# EAGLE schematic TestNode V1 (EAGLE 6.4)
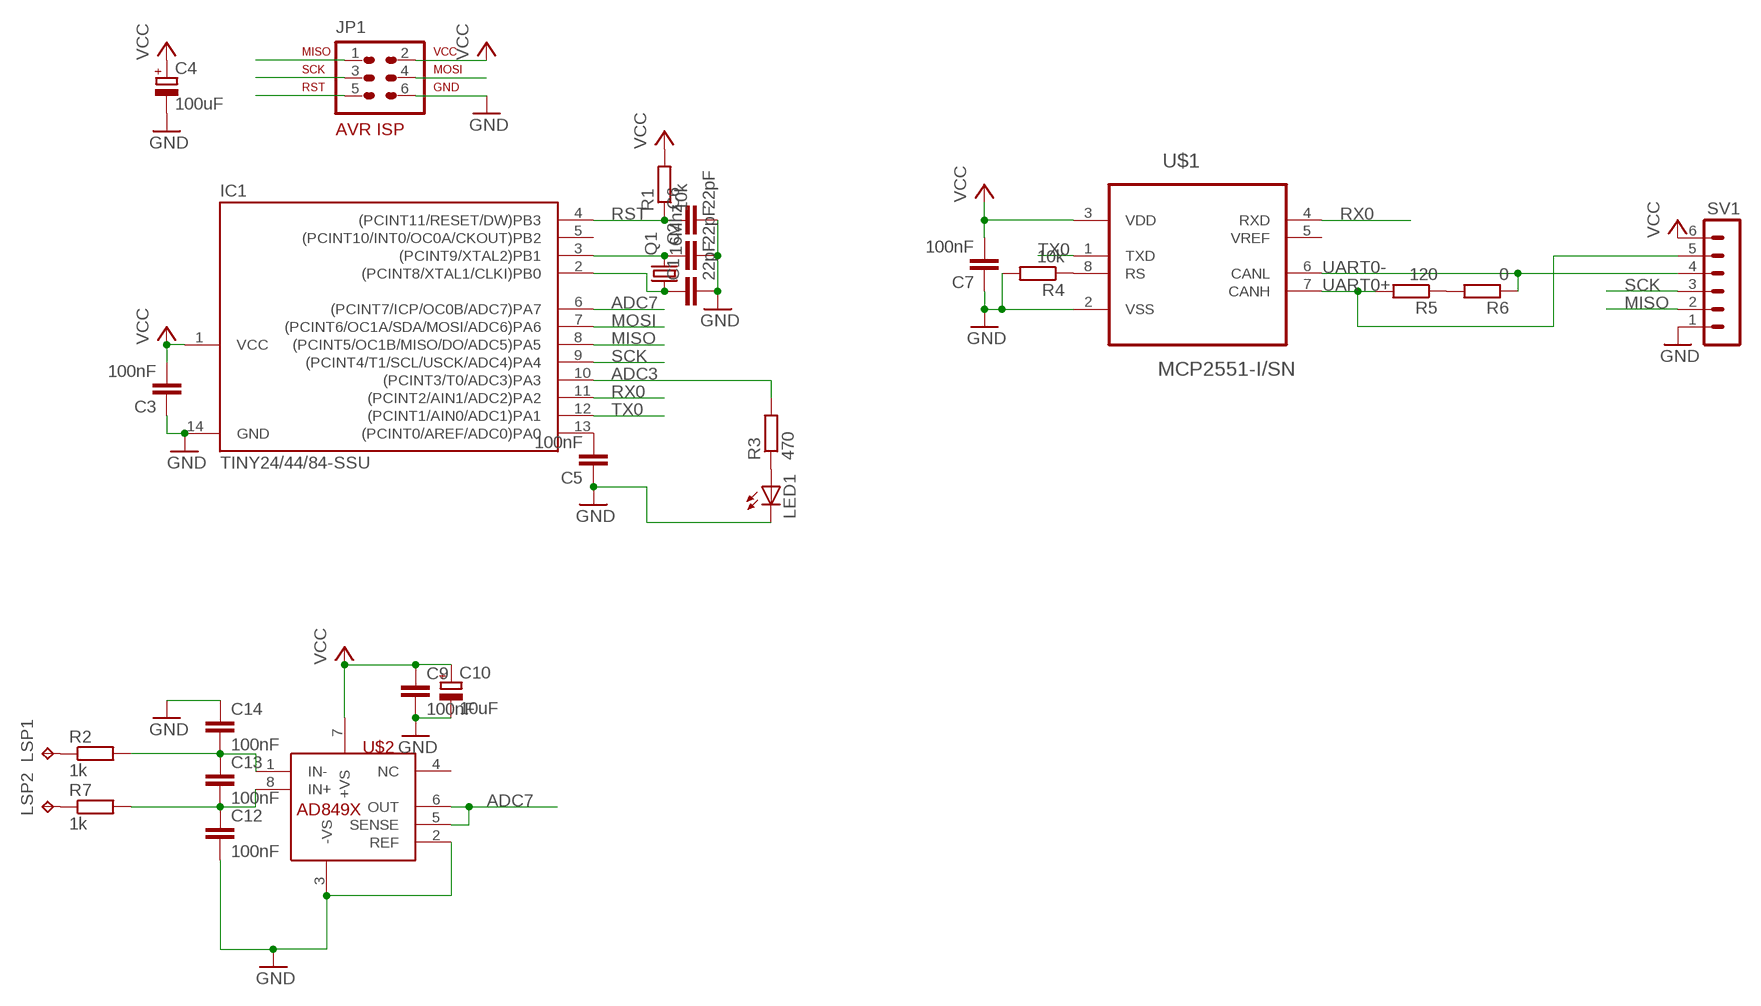
[diagram p0: schematic, sheet 1]

## Parts
C1  22pF  C-EUC1206  [C1206]
C2  22pF  C-EUC1206  [C1206]
C3  100nF  C-EUC1206  [C1206]
C4  100uF  CPOL-EUD  [PANASONIC_D]
C5  100nF  C-EUC1206  [C1206]
C6  22pF  C-EUC1206  [C1206]
C7  100nF  C-EUC1206  [C1206]
C9  100nF  C-EUC1206  [C1206]
C10  10uF  CPOL-EUUD-4X5,8  [UD-4X5,8_NICHICON]
C12  100nF  C-EUC0805  [C0805]
C13  100nF  C-EUC0805  [C0805]
C14  100nF  C-EUC0805  [C0805]
IC1  TINY24/44/84-SSU  [SOIC14]
JP1  AVR-ISP-6VERT  [AVR-ISP-6]
LED1  LED5MM  [LED5MM]
LSP1  TPTP15R  [TP15R]
LSP2  TPTP15R  [TP15R]
Q1  16Mhz  CRYSTALSM49  [SM49]
R1  10k  R-EU_R1206  [R1206]
R2  1k  R-EU_R0805  [R0805]
R3  470  R-EU_R1206  [R1206]
R4  10k  R-EU_R1206  [R1206]
R5  120  R-EU_R1206  [R1206]
R6  0  R-EU_R1206  [R1206]
R7  1k  R-EU_R0805  [R0805]
SV1  MA06-1  [MA06-1]
U$1  MCP2551-I/SN  [SOIC127P600X175-8N]
U$2  AD849X  [MSOP8]

## Nets
ADC3: IC1.10((PCINT3/T0/ADC3)PA3) R3.2
ADC7: IC1.6((PCINT7/ICP/OC0B/ADC7)PA7) U$2.5(SENSE) U$2.6(OUT)
GND: C1.2 C2.2 C3.1 C4.- C5.1 C6.2 C7.1 C9.2 C10.- C12.2 C14.1 IC1.14(GND) JP1.6 LED1.K(C) R4.2 SV1.1 U$1.2(VSS) U$2.2(REF) U$2.3(-VS)
MISO: IC1.8((PCINT5/OC1B/MISO/DO/ADC5)PA5) JP1.1 SV1.2
MOSI: IC1.7((PCINT6/OC1A/SDA/MOSI/ADC6)PA6) JP1.4
N$1: C1.1 IC1.2((PCINT8/XTAL1/CLKI)PB0) Q1.1
N$2: C2.1 IC1.3((PCINT9/XTAL2)PB1) Q1.2
N$3: C12.1 C13.2 R7.2 U$2.8(IN+)
N$4: C5.2 IC1.13((PCINT0/AREF/ADC0)PA0)
N$5: R4.1 U$1.8(RS)
N$6: LED1.A R3.1
N$7: R5.1 R6.2
N$8: C13.1 C14.2 R2.2 U$2.1(IN-)
N$10: LSP1.TP R2.1
N$11: LSP2.TP R7.1
RST: C6.1 IC1.4((PCINT11/RESET/DW)PB3) JP1.5 R1.1
RX0: IC1.11((PCINT2/AIN1/ADC2)PA2) U$1.4(RXD)
SCK: IC1.9((PCINT4/T1/SCL/USCK/ADC4)PA4) JP1.3 SV1.3
TX0: IC1.12((PCINT1/AIN0/ADC1)PA1) U$1.1(TXD)
UART0+: R5.2 SV1.5 U$1.7(CANH)
UART0-: R6.1 SV1.4 U$1.6(CANL)
VCC: C3.2 C4.+ C7.2 C9.1 C10.+ IC1.1(VCC) JP1.2 R1.2 SV1.6 U$1.3(VDD) U$2.7(+VS)
Unconnected: IC1.5((PCINT10/INT0/OC0A/CKOUT)PB2) U$1.5(VREF) U$2.4(NC)

## Library data of the parts
C1-C3 C5-C7 C9 C12-C14 = rcl:C-EU: CAPACITOR, European symbol
C4 = rcl:CPOL-EU: POLARIZED CAPACITOR, European symbol; FARNELL: 107SML016M
C10 = rcl:CPOL-EU: POLARIZED CAPACITOR, European symbol
IC1 = avr-7:TINY24/44/84
JP1 = avr-7:AVR-ISP-6: AVR ISP-6 Serial Programming Header
LED1 = led:LED: LED OSRAM: - CHIPLED LG R971, LG N971, LY N971, LG Q971, LY Q971, LO R971, LY R971 LH N974, LH R974 LS Q976, LO Q976, LY Q976 LO Q996 - Hyper CHIPLED LW Q18S LB Q993, LB Q99A, LB R99A - SideLED LS A670, LO A670, LY A670, LG A670, LP A670 LB A673, LV A673, LT A673, LW A673 LH A674 LY A675 LS A676, LA A676, LO A676, LY A676, LW A676 LS A679, LY A679, LG A679 - Hyper Micro SIDELED® LS Y876, LA Y876, LO Y876, LY Y876 LT Y87S - SmartLED LW L88C, LW L88S LB L89C, LB L89S, LG L890 LS L89K, LO L89K, LY L89K LS L896, LA L896, LO L896, LY L896 - TOPLED LS T670, LO T670, LY T670, LG T670, LP T670 LSG T670, LSP T670, LSY T670, LOP T670, LYG T670 LG T671, LOG T671, LSG T671 LB T673, LV T673, LT T673, LW T673 LH T674 LS T676, LA T676, LO T676, LY T676, LB T676, LH T676, LSB T676, LW T676 LB T67C, LV T67C, LT T67C, LS T67K, LO T67K, LY T67K, LW E67C LS E67B, LA E67B, LO E67B, LY E67B, LB E67C, LV E67C, LT E67C LW T67C LS T679, LY T679, LG T679 LS T770, LO T770, LY T770, LG T770, LP T770 LB T773, LV T773, LT T773, LW T773 LH T774 LS E675, LA E675, LY E675, LS T675 LS T776, LA T776, LO T776, LY T776, LB T776 LHGB T686 LT T68C, LB T68C - Hyper Mini TOPLED® LB M676 - Mini TOPLED Santana® LG M470 LS M47K, LO M47K, LY M47K Source: http://www.osram.convergy.de LUXEON: - LUMILED® LXK2-PW12-R00, LXK2-PW12-S00, LXK2-PW14-U00, LXK2-PW14-V00 LXK2-PM12-R00, LXK2-PM12-S00, LXK2-PM14-U00 LXK2-PE12-Q00, LXK2-PE12-R00, LXK2-PE12-S00, LXK2-PE14-T00, LXK2-PE14-U00 LXK2-PB12-K00, LXK2-PB12-L00, LXK2-PB12-M00, LXK2-PB14-N00, LXK2-PB14-P00, LXK2-PB14-Q00 LXK2-PR12-L00, LXK2-PR12-M00, LXK2-PR14-Q00, LXK2-PR14-R00 LXK2-PD12-Q00, LXK2-PD12-R00, LXK2-PD12-S00 LXK2-PH12-R00, LXK2-PH12-S00 LXK2-PL12-P00, LXK2-PL12-Q00, LXK2-PL12-R00 Source: www.luxeon.com KINGBRIGHT: KA-3528ASYC Source: www.kingbright.com
LSP1 LSP2 = testpad:TP: Test pad
Q1 = crystal:CRYSTAL: CRYSTAL; OC_FARNELL: unknown; OC_NEWARK: unknown
R1-R7 = rcl:R-EU_: RESISTOR, European symbol
SV1 = con-lstb:MA06-1: PIN HEADER; OC_FARNELL: unknown; OC_NEWARK: unknown
U$1 = mcp:MCP2551-I/SN: High-Speed CAN Transceiver; MPN: MCP2551-I/SN; OC_FARNELL: 9758569; OC_NEWARK: 69K7604; PACKAGE: SOIC-8; SUPPLIER: Microchip
U$2 = ad849x:AD849X